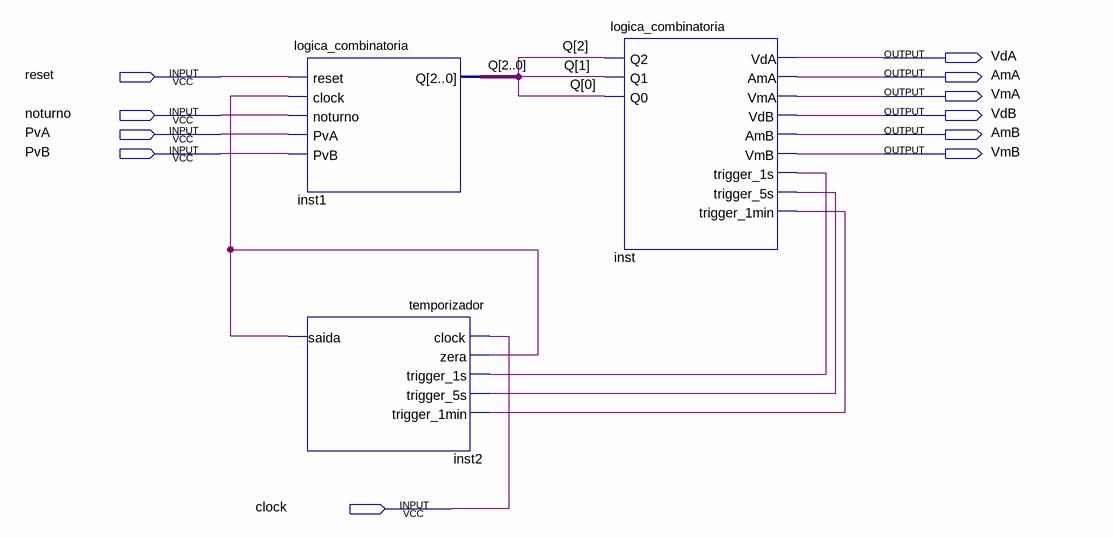
[diagram p0: schematic sheet]
// Quartus schematic montagem_final.bdf as structural Verilog: 3 symbols, 11 pins
module montagem_final (
  input  reset,
  input  noturno,
  input  PvA,
  input  PvB,
  input  clock,
  output VdA,
  output AmA,
  output VmA,
  output VdB,
  output AmB,
  output VmB
);

  wire inst2_saida, inst_trigger_1min, inst_trigger_1s, inst_trigger_5s;
  wire [2:0] Q;

  logica_combinatoria inst1 (.reset(reset), .clock(inst2_saida), .noturno(noturno), .PvA(PvA), .PvB(PvB), .Q(Q));
  temporizador inst2 (
    .clock(clock), .zera(inst2_saida), .trigger_1s(inst_trigger_1s), .trigger_5s(inst_trigger_5s),
    .trigger_1min(inst_trigger_1min), .saida(inst2_saida));
  logica_combinatoria inst (
    .Q2(Q[2]), .Q1(Q[1]), .Q0(Q[0]), .VdA(VdA), .AmA(AmA), .VmA(VmA), .VdB(VdB), .AmB(AmB), .VmB(VmB),
    .trigger_1s(inst_trigger_1s), .trigger_5s(inst_trigger_5s), .trigger_1min(inst_trigger_1min));
endmodule
